# Altium project Micromouse-aDual.PrjPcb
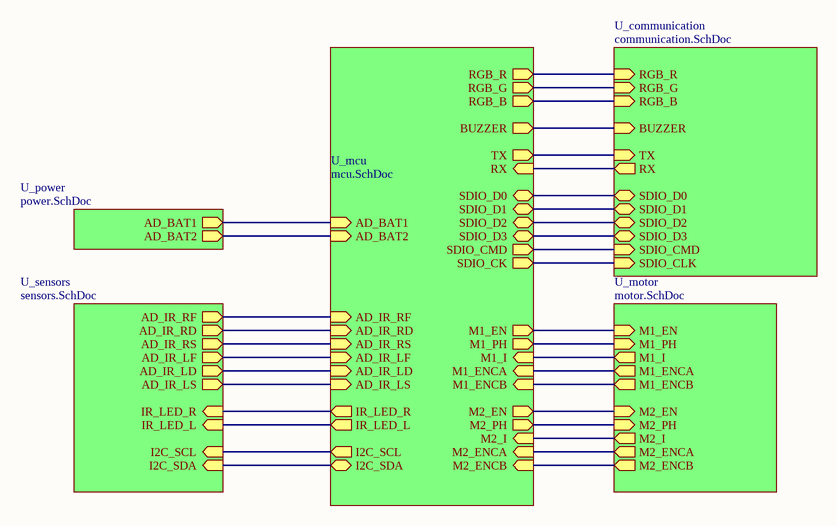
[diagram p0: Hierarchi.SchDoc]
6 sheets, 108 parts. Net scope: hierarchical (ports join the sheet entries above them; power ports are global).
Board file: aDual_v2.PcbDoc
Sheets:
  Hierarchi.SchDoc
    U_mcu = mcu.SchDoc
    U_motor = motor.SchDoc
    U_power = power.SchDoc
    U_sensors = sensors.SchDoc
    U_communication = communication.SchDoc

## Sheet Hierarchi.SchDoc
size A

### Sub-sheets
U_communication = communication.SchDoc: BUZZER (in), RGB_R (in), RGB_B (in), RGB_G (in), SDIO_D2 (bidir), SDIO_D3 (bidir), SDIO_CMD (in), SDIO_CLK (in), SDIO_D0 (bidir), SDIO_D1 (bidir), RX (out), TX (in)
U_mcu = mcu.SchDoc: AD_IR_LF (in), AD_IR_RF (in), AD_IR_LS (in), AD_IR_RS (in), AD_IR_RD (in), AD_IR_LD (in), M1_ENCA (in), M1_ENCB (in), M1_EN (out), M1_PH (out), M1_I (in), M2_EN (out), AD_BAT1 (in), AD_BAT2 (in), M2_PH (out), M2_I (in), M2_ENCA (in), M2_ENCB (in), I2C_SCL (out), I2C_SDA (bidir), IR_LED_L (out), IR_LED_R (out), SDIO_D3 (bidir), RX (in), RGB_R (out), BUZZER (out), RGB_G (out), TX (out), SDIO_D1 (bidir), SDIO_CK (out), SDIO_D0 (bidir), RGB_B (out), SDIO_CMD (out), SDIO_D2 (bidir)
U_motor = motor.SchDoc: M1_EN (in), M1_PH (in), M1_I (out), M1_ENCA (out), M1_ENCB (out), M2_EN (in), M2_PH (in), M2_I (out), M2_ENCA (out), M2_ENCB (out)
U_power = power.SchDoc: AD_BAT1 (out), AD_BAT2 (out)
U_sensors = sensors.SchDoc: AD_IR_LF (out), AD_IR_RD (out), AD_IR_LS (out), AD_IR_RS (out), AD_IR_LD (out), AD_IR_RF (out), I2C_SDA (in), I2C_SCL (in), IR_LED_L (in), IR_LED_R (in)

### Nets
AD_BAT1: sheet U_mcu/AD_BAT1, sheet U_power/AD_BAT1
AD_BAT2: sheet U_mcu/AD_BAT2, sheet U_power/AD_BAT2
AD_IR_LD: sheet U_mcu/AD_IR_LD, sheet U_sensors/AD_IR_LD
AD_IR_LF: sheet U_mcu/AD_IR_LF, sheet U_sensors/AD_IR_LF
AD_IR_LS: sheet U_mcu/AD_IR_LS, sheet U_sensors/AD_IR_LS
AD_IR_RD: sheet U_mcu/AD_IR_RD, sheet U_sensors/AD_IR_RD
AD_IR_RF: sheet U_mcu/AD_IR_RF, sheet U_sensors/AD_IR_RF
AD_IR_RS: sheet U_mcu/AD_IR_RS, sheet U_sensors/AD_IR_RS
BUZZER: sheet U_mcu/BUZZER, sheet U_communication/BUZZER
IR_LED_L: sheet U_mcu/IR_LED_L, sheet U_sensors/IR_LED_L
IR_LED_R: sheet U_mcu/IR_LED_R, sheet U_sensors/IR_LED_R
M1_EN: sheet U_mcu/M1_EN, sheet U_motor/M1_EN
M1_ENCA: sheet U_mcu/M1_ENCA, sheet U_motor/M1_ENCA
M1_ENCB: sheet U_mcu/M1_ENCB, sheet U_motor/M1_ENCB
M1_I: sheet U_mcu/M1_I, sheet U_motor/M1_I
M1_PH: sheet U_mcu/M1_PH, sheet U_motor/M1_PH
M2_EN: sheet U_mcu/M2_EN, sheet U_motor/M2_EN
M2_ENCA: sheet U_mcu/M2_ENCA, sheet U_motor/M2_ENCA
M2_ENCB: sheet U_mcu/M2_ENCB, sheet U_motor/M2_ENCB
M2_I: sheet U_mcu/M2_I, sheet U_motor/M2_I
M2_PH: sheet U_mcu/M2_PH, sheet U_motor/M2_PH
RGB_B: sheet U_mcu/RGB_B, sheet U_communication/RGB_B
RGB_G: sheet U_mcu/RGB_G, sheet U_communication/RGB_G
RGB_R: sheet U_mcu/RGB_R, sheet U_communication/RGB_R
RX: sheet U_mcu/RX, sheet U_communication/RX
SDIO_CK: sheet U_mcu/SDIO_CK, sheet U_communication/SDIO_CLK
SDIO_CMD: sheet U_mcu/SDIO_CMD, sheet U_communication/SDIO_CMD
SDIO_D0: sheet U_mcu/SDIO_D0, sheet U_communication/SDIO_D0
SDIO_D1: sheet U_mcu/SDIO_D1, sheet U_communication/SDIO_D1
SDIO_D2: sheet U_mcu/SDIO_D2, sheet U_communication/SDIO_D2
SDIO_D3: sheet U_mcu/SDIO_D3, sheet U_communication/SDIO_D3
TX: sheet U_mcu/TX, sheet U_communication/TX
NetIC4_19: sheet U_mcu/I2C_SCL, sheet U_sensors/I2C_SCL
NetIC4_20: sheet U_mcu/I2C_SDA, sheet U_sensors/I2C_SDA

## Sheet mcu.SchDoc: Micromouse aDual
size A
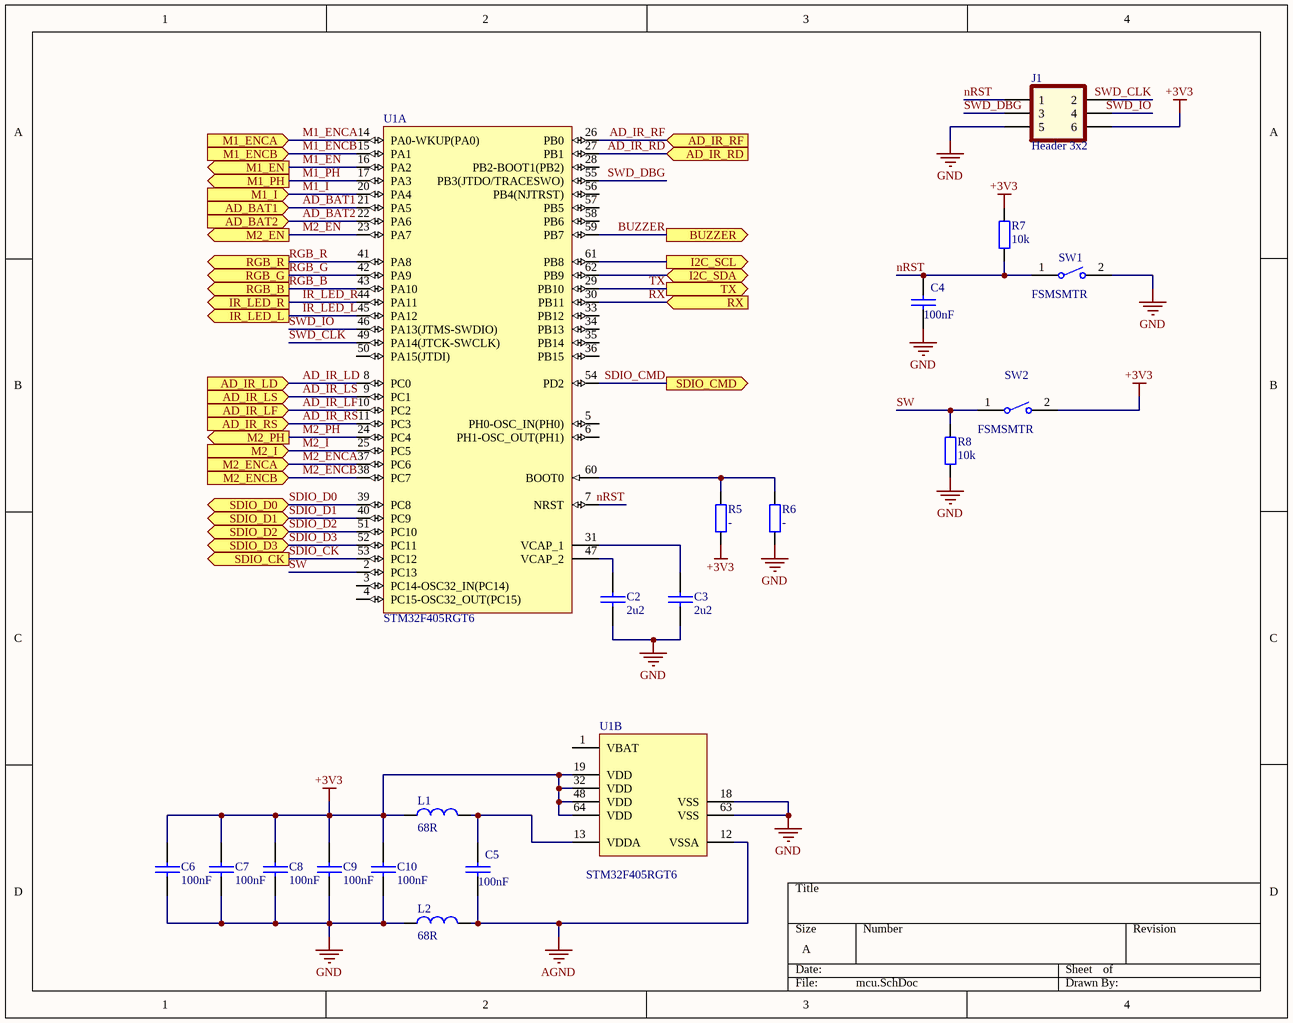
[diagram p1: mcu.SchDoc]

### Parts
C2  2u2  [C0402-Paste]
C3  2u2  [C0402-Paste]
C4  100nF  [C0402-Paste]
C5  100nF  [C0402-Paste]
C6  100nF  [C0402-Paste]
C7  100nF  [C0402-Paste]
C8  100nF  [C0402-Paste]
C9  100nF  [C0402-Paste]
C10  100nF  [C0402-Paste]
J1  Header 3x2  [CON-6x2]
L1  68R  [L0603_PASTE]
L2  68R  [L0603_PASTE]
R5  -  [R0402-Paste]
R6  -  [R0402-Paste]
R7  10k  [R0603_PASTE]
R8  10k  [R0603_PASTE]
SW1  FSMSMTR  [TECO-FSMSMTR_V]
SW2  FSMSMTR  [TECO-FSMSMTR_V]
U1  STM32F405RGT6  [STM-LQFP64_M]  (parts A,B of 2)

### Ports
AD_BAT1 (in), AD_BAT2 (in), AD_IR_LD (in), AD_IR_LF (in), AD_IR_LS (in), AD_IR_RD (in), AD_IR_RF (in), AD_IR_RS (in), BUZZER (out), I2C_SCL (out), I2C_SDA (bidir), IR_LED_L (out), IR_LED_R (out), M1_EN (out), M1_ENCA (in), M1_ENCB (in), M1_I (in), M1_PH (out), M2_EN (out), M2_ENCA (in), M2_ENCB (in), M2_I (in), M2_PH (out), RGB_B (out), RGB_G (out), RGB_R (out), RX (in), SDIO_CK (out), SDIO_CMD (out), SDIO_D0 (bidir), SDIO_D1 (bidir), SDIO_D2 (bidir), SDIO_D3 (bidir), TX (out)

### Nets
+3V3: C6.2 C7.2 C8.2 C9.2 C10.2 J1.6 L1.1 R5.2 R7.1 SW2.2 U1.19(VDD) U1.32(VDD) U1.48(VDD) U1.64(VDD)
AGND: C5.1 L2.2 U1.12(VSSA)
GND: C2.1 C3.1 C4.1 C6.1 C7.1 C8.1 C9.1 C10.1 J1.5 L2.1 R6.2 R8.2 SW1.2 U1.18(VSS) U1.63(VSS)
AD_BAT1: U1.21(PA5) ; port AD_BAT1
AD_BAT2: U1.22(PA6) ; port AD_BAT2
AD_IR_LD: U1.8(PC0) ; port AD_IR_LD
AD_IR_LF: U1.10(PC2) ; port AD_IR_LF
AD_IR_LS: U1.9(PC1) ; port AD_IR_LS
AD_IR_RD: U1.27(PB1) ; port AD_IR_RD
AD_IR_RF: U1.26(PB0) ; port AD_IR_RF
AD_IR_RS: U1.11(PC3) ; port AD_IR_RS
BUZZER: U1.59(PB7) ; port BUZZER
IR_LED_L: U1.45(PA12) ; port IR_LED_L
IR_LED_R: U1.44(PA11) ; port IR_LED_R
M1_EN: U1.16(PA2) ; port M1_EN
M1_ENCA: U1.14(PA0-WKUP(PA0)) ; port M1_ENCA
M1_ENCB: U1.15(PA1) ; port M1_ENCB
M1_I: U1.20(PA4) ; port M1_I
M1_PH: U1.17(PA3) ; port M1_PH
M2_EN: U1.23(PA7) ; port M2_EN
M2_ENCA: U1.37(PC6) ; port M2_ENCA
M2_ENCB: U1.38(PC7) ; port M2_ENCB
M2_I: U1.25(PC5) ; port M2_I
M2_PH: U1.24(PC4) ; port M2_PH
nRST: C4.2 J1.1 R7.2 SW1.1 U1.7(NRST)
RGB_B: U1.43(PA10) ; port RGB_B
RGB_G: U1.42(PA9) ; port RGB_G
RGB_R: U1.41(PA8) ; port RGB_R
RX: U1.30(PB11) ; port RX
SDIO_CK: U1.53(PC12) ; port SDIO_CK
SDIO_CMD: U1.54(PD2) ; port SDIO_CMD
SDIO_D0: U1.39(PC8) ; port SDIO_D0
SDIO_D1: U1.40(PC9) ; port SDIO_D1
SDIO_D2: U1.51(PC10) ; port SDIO_D2
SDIO_D3: U1.52(PC11) ; port SDIO_D3
SW: R8.1 SW2.1 U1.2(PC13)
SWD_CLK: J1.2 U1.49(PA14(JTCK-SWCLK))
SWD_DBG: J1.3 U1.55(PB3(JTDO/TRACESWO))
SWD_IO: J1.4 U1.46(PA13(JTMS-SWDIO))
TX: U1.29(PB10) ; port TX
NetC2_2: C2.2 U1.47(VCAP_2)
NetC3_2: C3.2 U1.31(VCAP_1)
NetC5_2: C5.2 L1.2 U1.13(VDDA)
NetIC4_19: U1.61(PB8) ; port I2C_SCL
NetIC4_20: U1.62(PB9) ; port I2C_SDA
NetR5_1: R5.1 R6.1 U1.60(BOOT0)

Not connected (* = marked no-connect by the designer): U1 1(VBAT) 3(PC14-OSC32_IN(PC14)) 4(PC15-OSC32_OUT(PC15)) 5(PH0-OSC_IN(PH0)) 6(PH1-OSC_OUT(PH1)) 28(PB2-BOOT1(PB2)) 33(PB12) 34(PB13) 35(PB14) 36(PB15) 50(PA15(JTDI)) 56(PB4(NJTRST)) 57(PB5) 58(PB6)

### Library data of the parts
C2-C10 = C-0402: CAP CER 0.1UF 16V Y5V 0402; Manufacturer: Samsung Electro-Mechanics; Manufacturer PN: CL05F104ZO5NNNC; Supplier: digikey.ca
  C2 C3: Value: 2u2
  C4-C10: Value: 100nF
J1 = Header 3x2: CONN HEADER VERT 6POS 2.54MM; Manufacturer: Sullins Connector Solutions; Manufacturer PN: PBC03DAAN; Value: Header 3x2; supplier: digikey.ca
L1 L2 = L-0603: FERRITE BEAD 0603; Manufacturer: Laird-Signal Integrity Products; Manufacturer PN: MI0603J680R-10; Value: 68R; Supplier: digikey.ca
R5 R6 = R-0402: RES SMD 0402; Value: -; Manufacturer: -; Manufacturer PN: -; Supplier: digikey.ca
R7 R8 = R-0603: RES SMD 0603; Value: 10k; Manufacturer: -; Manufacturer PN: -; Supplier: digikey.ca
SW1 SW2 = CMP-2000-07501-1: FSMSM Push Button Switch, 50 mA, -35 to 85 degC, 2-Pin SMD, RoHS, Tape and Reel; Manufacturer: TE Connectivity; Voltage Rating (DC): 24V; Electrical Life: 20000Cycles; Operating Force: 180gf; Switch Travel: 0.25mm; Contact Current Rating: 50mA; Case\/Package: SMD/SMT; Actuator Length: 1.07mm; Throw Configuration: SPST; Actuator Material: Polyamide; Contact Resistance: 100mOhm; Illumination Type: Illuminated; Max Voltage Rating (DC): 12V; Manufacturer URL: http://www.te.com/; Lead Free: LeadFree; Packaging: TapeandReel; Min Operating Temperature: -35degC; Mechanical Life: 20000Cycles; Mount: SurfaceMount; REACH SVHC: Unknown; Package Quantity: 1800; Package Reference: FSMSMTR; RoHSCompliant: true; Max Operating Temperature: 85degC; Orientation: Straight; ELV: Compliant; Datasheet URL: http://www.te.com/commerce/DocumentDelivery/DDEController?Action=showdoc&DocId=Customer+Drawing%7F1437566-3%7FC2%7Fpdf%7FEnglish%7FENG_CD_1437566-3_C2_1437566_3_1_c.dwg.pdf%7F1437566-4; Package Description: 2-Pin Surface Mount Device, Body 6 x 3.5 mm, Pitch 9.19 mm; Current Rating: 50mA; Contact Plating: Silver; Termination: GullWing; Datasheet Version: Rev. C2, 08/2014; Contact Material: Brass; Mounting Technology: SurfaceMount
U1 = CMP-0243-00019-3: ARM Cortex-M4 32-bit MCU+FPU, 210 DMIPS, 1024 kB Flash, 192 kB Internal RAM, 51 I/Os, 64-pin LQFP, -40 to 85 degC, Tray; Manufacturer: STMicroelectronics; Supply Voltage(Vcc) min (V): 1.8; Supply Voltage(Vcc) max (V): 3.6; Internal RAM Size (kB): 192; I/Os (High Current): 51; D/A Converter: 2x12-bit; FLASH Size (Prog) (kB): 1024; Operating Frequency(F) (Processor speed) (MHz): 168; ComponentLink2Description: Datasheet; PackageVersion: Rev. 4, 06/2013; DatasheetVersion: Rev. 4; Core: ARM Cortex-M4; ComponentLink2URL: http://www.st.com/st-web-ui/static/active/en/resource/technical/document/datasheet/DM00037051.pdf; PackageReference: LQFP64; Packing: Tray; ComponentLink1Description: Manufacturer URL; ComponentLink3URL: http://www.st.com/st-web-ui/static/active/en/resource/technical/document/datasheet/DM00037051.pdf; ComponentLink3Description: Package Specification; Mounting Technology: Surface Mount; ComponentLink1URL: http://www.st.com/web/en/home.html; PackageDescription: 64-Pin Low Profile Quad Flat Package, 10 x 10 mm Body, 0.5 mm Pitch; PartNumber: STM32F405RGT6

## Sheet motor.SchDoc
size A
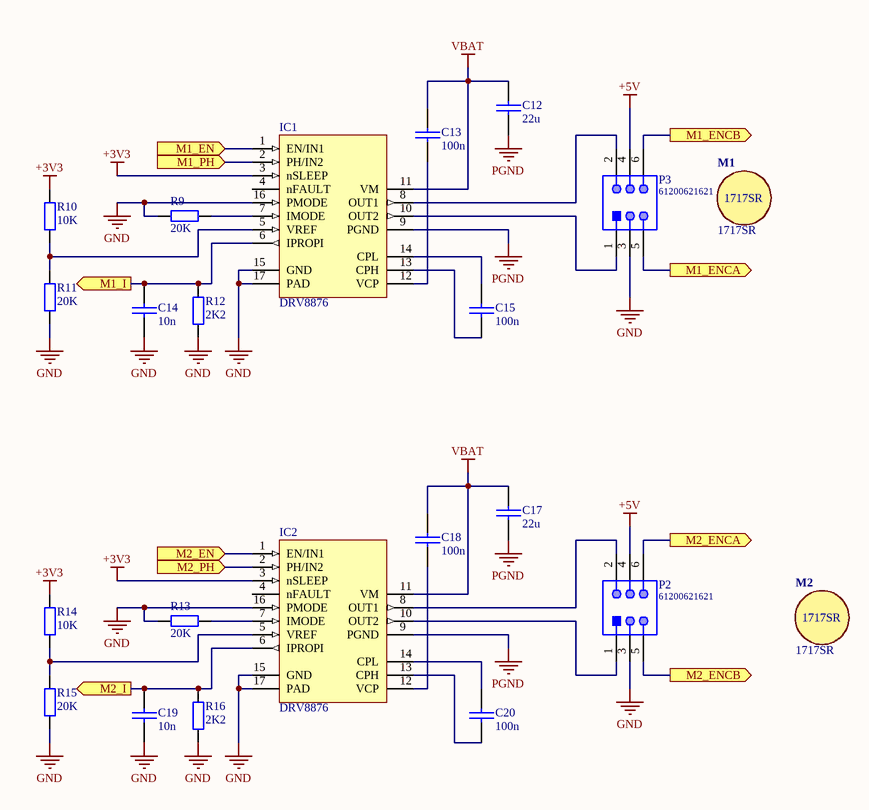
[diagram p2: motor.SchDoc]

### Parts
C12  22u  [C0603_PASTE]
C13  100n  [C0402-Paste]
C14  10n  [C0402-Paste]
C15  100n  [C0402-Paste]
C17  22u  [C0603_PASTE]
C18  100n  [C0402-Paste]
C19  10n  [C0402-Paste]
C20  100n  [C0402-Paste]
IC1  DRV8876  [TSSOP-16H]
IC2  DRV8876  [TSSOP-16H]
M1  1717SR  [Motor]
M2  1717SR  [Motor]
P2  61200621621  [61200621621]
P3  61200621621  [61200621621]
R9  20K  [R0402-Paste]
R10  10K  [R0402-Paste]
R11  20K  [R0402-Paste]
R12  2K2  [R0402-Paste]
R13  20K  [R0402-Paste]
R14  10K  [R0402-Paste]
R15  20K  [R0402-Paste]
R16  2K2  [R0402-Paste]

### Ports
M1_EN (in), M1_ENCA (out), M1_ENCB (out), M1_I (out), M1_PH (in), M2_EN (in), M2_ENCA (out), M2_ENCB (out), M2_I (out), M2_PH (in)

### Nets
+3V3: IC1.3(nSLEEP) IC2.3(nSLEEP) R10.2 R14.2
+5V: P2.4 P3.4
GND: C14.2 C19.2 IC1.15(GND) IC1.16(PMODE) IC1.17(PAD) IC2.15(GND) IC2.16(PMODE) IC2.17(PAD) P2.3 P3.3 R9.1 R11.1 R12.1 R13.1 R15.1 R16.1
PGND: C12.2 C17.2 IC1.9(PGND) IC2.9(PGND)
VBAT: C12.1 C13.1 C17.1 C18.1 IC1.11(VM) IC2.11(VM)
M1_EN: IC1.1(EN/IN1) ; port M1_EN
M1_ENCA: P3.5 ; port M1_ENCA
M1_ENCB: P3.6 ; port M1_ENCB
M1_I: C14.1 IC1.6(IPROPI) R12.2 ; port M1_I
M1_PH: IC1.2(PH/IN2) ; port M1_PH
M2_EN: IC2.1(EN/IN1) ; port M2_EN
M2_ENCA: P2.6 ; port M2_ENCA
M2_ENCB: P2.5 ; port M2_ENCB
M2_I: C19.1 IC2.6(IPROPI) R16.2 ; port M2_I
M2_PH: IC2.2(PH/IN2) ; port M2_PH
NetC13_2: C13.2 IC1.12(VCP)
NetC15_1: C15.1 IC1.14(CPL)
NetC15_2: C15.2 IC1.13(CPH)
NetC18_2: C18.2 IC2.12(VCP)
NetC20_1: C20.1 IC2.14(CPL)
NetC20_2: C20.2 IC2.13(CPH)
NetIC1_5: IC1.5(VREF) R10.1 R11.2
NetIC1_7: IC1.7(IMODE) R9.2
NetIC1_8: IC1.8(OUT1) P3.2
NetIC1_10: IC1.10(OUT2) P3.1
NetIC2_5: IC2.5(VREF) R14.1 R15.2
NetIC2_7: IC2.7(IMODE) R13.2
NetIC2_8: IC2.8(OUT1) P2.2
NetIC2_10: IC2.10(OUT2) P2.1

Not connected (* = marked no-connect by the designer): IC1 4(nFAULT); IC2 4(nFAULT)

### Library data of the parts
C12 C17 = C-0603: Multilayer Ceramic Capacitors MLCC - SMD 0603; Value: 22u; Manufacturer: -; Manufacturer PN: -; Supplier: digikey.ca
C13-C15 C18-C20 = C-0402: Multilayer Ceramic Capacitors MLCC - SMD  0402; Manufacturer: -; Manufacturer PN: -; Supplier: digikey.ca
  C13 C15 C18 C20: Value: 100n
  C14 C19: Value: 10n
IC1 IC2 = DRV8876: PWR MGMT MOTOR/FAN DRIVER; pin to pad: 17>HS; Supplier 1: Mouser; ComponentLink1Description: Digy-key; ComponentLink1URL: https://www.digikey.sk/product-detail/en/texas-instruments/DRV8876PWPR/296-53515-1-ND/10270213; ComponentLink2Description: Datasheet; ComponentLink2URL: www.ti.com/lit/ds/symlink/drv8876.pdf; Supplier Part Number 1: 595-DRV8876PWPR; Value: DRV8876
P2 P3 = CMP-1502-00000-1: Male Box Header WR-BHD, THT, Vertical, pitch 2.54 mm, 6 pins; Manufacturer: Wurth Elektronik; Withstanding Voltage: 500VAC; Working Voltage: 250VAC; Pin Number: 6; Pitch: 2.54mm; Contact Resistance: 20mOhm; Part Number: 61200621621; Manufacturer URL: http://www.we-online.de; Published Date: August2018; Orientation: Vertical; Publisher: WurthElektronik; Operating Temperature: -40to125degC; Datasheet URL: https://katalog.we-online.de/em/datasheet/6120xx21621.pdf; Mounting Technology: THT; Packaging: Tray; Gender: Male; Package Reference: 61200621621
R9-R16 = R-0402: RES SMD 0402; Manufacturer: -; Manufacturer PN: -; Supplier: digikey.ca
  R9 R11 R13 R15: Value: 20K
  R10 R14: Value: 10K
  R12 R16: Value: 2K2

## Sheet power.SchDoc
size A
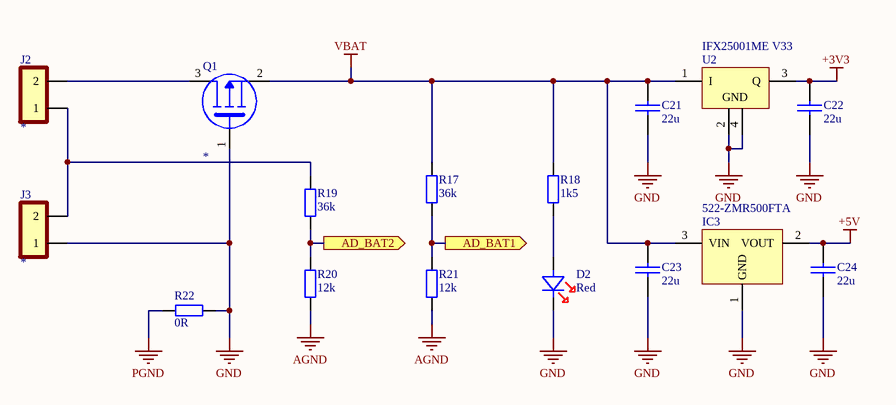
[diagram p3: power.SchDoc]

### Parts
C21  22u  [C0603_PASTE]
C22  22u  [C0603_PASTE]
C23  22u  [C0603_PASTE]
C24  22u  [C0603_PASTE]
D2  Red  [LED0402_RED]
IC3  Supplier Part Number 1: 522-ZMR500FTA  [SOT-23]  (hidden comment: ZMR500FTA)
J2  *  [CON-2x1-JMP]
J3  *  [CON-2x1-JMP]
Q1  *  [SOT-23]
R17  36k  [R0603_PASTE]
R18  1k5  [R0603_PASTE]
R19  36k  [R0603_PASTE]
R20  12k  [R0603_PASTE]
R21  12k  [R0603_PASTE]
R22  0R  [R0201-paste]
U2  IFX25001ME V33  [INF-PG-SOT223_SC-73_L]

### Ports
AD_BAT1 (out), AD_BAT2 (out)

### Nets
+3V3: C22.1 U2.3(Q)
+5V: C24.1 IC3.2(VOUT)
AGND: R20.2 R21.2
GND: C21.2 C22.2 C23.2 C24.2 D2.2(CATHODE) IC3.1(GND) J3.1 Q1.1(GATE) R22.2 U2.2(GND) U2.4(GND)
PGND: R22.1
VBAT: C21.1 C23.1 IC3.3(VIN) Q1.2(DRAIN) R17.1 R18.1 U2.1(I)
AD_BAT1: R17.2 R21.1 ; port AD_BAT1
AD_BAT2: R19.2 R20.1 ; port AD_BAT2
NetD2_1: D2.1(ANODE) R18.2
NetJ2_1: J2.1 J3.2 R19.1
NetJ2_2: J2.2 Q1.3(SOURCE)

### Library data of the parts
C21-C24 = C-0603: as C12 on sheet motor; Value: 22u; Manufacturer: -; Manufacturer PN: -; Supplier: digikey.ca
D2 = LED_0402_Red: Standard LEDs - SMD SMD 0402 Red; Manufacturer PN: XZMDK68W-2; Manufacturer: SunLED; Value: Red; Supplier: digikey.com
IC3 = ZMR500FTA: IC REG LINEAR 5V 50MA SOT23-3; Manufacturer 1: Diodes Zetex; Max Input Voltage: 25V; Min Input Voltage: 7V; Number of Outputs: 1; Max Power Dissipation: 500mW; Polarity: Positive; Output Type: Fixed; Dropout Voltage: 1.2V; Quiescent Current: 30uA; Power Supply Rejection Ratio (PSRR): 55dB; Supplier 1: Mouser; Manufacturer Part Number 1: ZMR500FTA; Stock 1: 9051; Pricing 1: 1=0.91000, 10=0.76000, 100=0.49000, 1000=0.39200, 3000=0.39200, 9000=0.39200 (USD); RoHS: Yes; Mount: Surface Mount; Case/Package: SOT-23; Number of Pins: 3; Weight: 0.000282oz; Min Operating Temperature: -55°C; Max Operating Temperature: 125°C; Output Voltage: 5V; Max Output Current: 50mA; Nominal Output Voltage: 5V; Packaging: Tape and Reel; Output Current: 50mA; Package Quantity: 3000; Power Rating: 500mW; Number of Regulators: 1; Power Dissipation: 500mW; Min Output Voltage: 5V; Length: 3.04mm; Height: 1.02mm; Width: 1.4mm; Radiation Hardening: No; REACH SVHC: No SVHC; Lead Free: Lead Free; ComponentLink1URL: https://datasheet.ciiva.com/15111/getdatasheetpartid-74239-15111397.pdf?src-supplier=Verical; ComponentLink1Description: https://datasheet.ciiva.com/15111/getdatasheetpartid-74239-15111397.pdf?src-supplier=Verical; ComponentLink2URL: https://datasheet.ciiva.com/5786/60079-5786598.pdf?src-supplier=Farnell; ComponentLink2Description: https://datasheet.ciiva.com/5786/60079-5786598.pdf?src-supplier=Farnell; ComponentLink3URL: https://datasheet.ciiva.com/26907/zmr500fta-26907457.pdf?src-supplier=IIIC; ComponentLink3Description: https://datasheet.ciiva.com/26907/zmr500fta-26907457.pdf?src-supplier=IIIC; ComponentLink4URL: https://datasheet.ciiva.com/8078/60079-8078251.pdf?src-supplier=Element14; ComponentLink4Description: https://datasheet.ciiva.com/8078/60079-8078251.pdf?src-supplier=Element14; ComponentLink5URL: https://datasheet.ciiva.com/8078/60079-8078252.pdf?src-supplier=Element14; ComponentLink5Description: https://datasheet.ciiva.com/8078/60079-8078252.pdf?src-supplier=Element14; ComponentLink6URL: https://datasheet.ciiva.com/16217/zmrseries-16217950.pdf?src-supplier=Future+Electronics; ComponentLink6Description: https://datasheet.ciiva.com/16217/zmrseries-16217950.pdf?src-supplier=Future+Electronics; ComponentLink7URL: https://datasheet.ciiva.com/8240/zmrseries-8240239.pdf?src-supplier=Avnet; ComponentLink7Description: https://datasheet.ciiva.com/8240/zmrseries-8240239.pdf?src-supplier=Avnet
J2 J3 = CON-2x1-JMP: 2 Positions Header 2.54mm; Manufacturer: Molex, LLC; Manufacturer PN: 0901200762; Value: *; Supplier: digikey.ca
Q1 = MOSFET-P: MOSFET P-CH  SOT23; Manufacturer PN: DMG2305UX-13; Manufacturer: Diodes Incorporated; Value: *; Supplier: digikey.ca
R17-R21 = R-0603: RES SMD 0603; Manufacturer: -; Manufacturer PN: -; Supplier: digikey.ca
  R17 R19: Value: 36k
  R18: Value: 1k5
  R20 R21: Value: 12k
R22 = R-0201: RES SMD 0201; Value: 0R; Manufacturer: -; Manufacturer PN: -; Supplier: digikey.ca
U2 = CMP-1136-00017-1: Low Dropout Voltage Regulator, 4.7 to 40 V Operating, 400 mA, -40 to 125 degC, PG-SOT223 (SC-73), Reel, Green; Manufacturer: Infineon; Typical Quiescent Current: 100 uA; Regulator Type: Linear->single output; Accuracy: 4.0Â %; Green: TRUE; Automotive Qualified: FALSE; Max Peak Reflow Temp: 260Â degreesC; Output Voltage: 3.3 V; Max. Output Current: 400 mA; Max Number Reflow: 3; Dropout Voltage: 700 mV; ComponentLink3URL: http://www.infineon.com/dgdl/SOT223-Package_Overview.pdf?folderId=db3a30431936bc4b0119530470b03c3d&fileId=db3a30431936bc4b0119531d40b93c5c; Packing: Reel; ComponentLink2Description: Datasheet; DatasheetVersion: Rev. 1.02; PackageDescription: 4-Pin Small Outline Transistor Package, 6.5 x 3.5 mm Body, 2.3 mm Pitch; MSL: 1; PackageVersion: Apr-08; Reset: FALSE; ComponentLink1URL: http://www.infineon.com/; PartNumber: IFX25001ME V33; ComponentLink1Description: Manufacturer URL; ComponentLink3Description: Package Specification; ComponentLink2URL: http://www.infineon.com/dgdl/IFX25001_DS_102.pdf?folderId=db3a30431ff988150120802bce1d257a&fileId=db3a304320d39d590120f620f1e269da; Status Output: FALSE; Mounting Technology: Surface Mount; PackageReference: PG-SOT223 (SC-73)

## Sheet sensors.SchDoc
size A
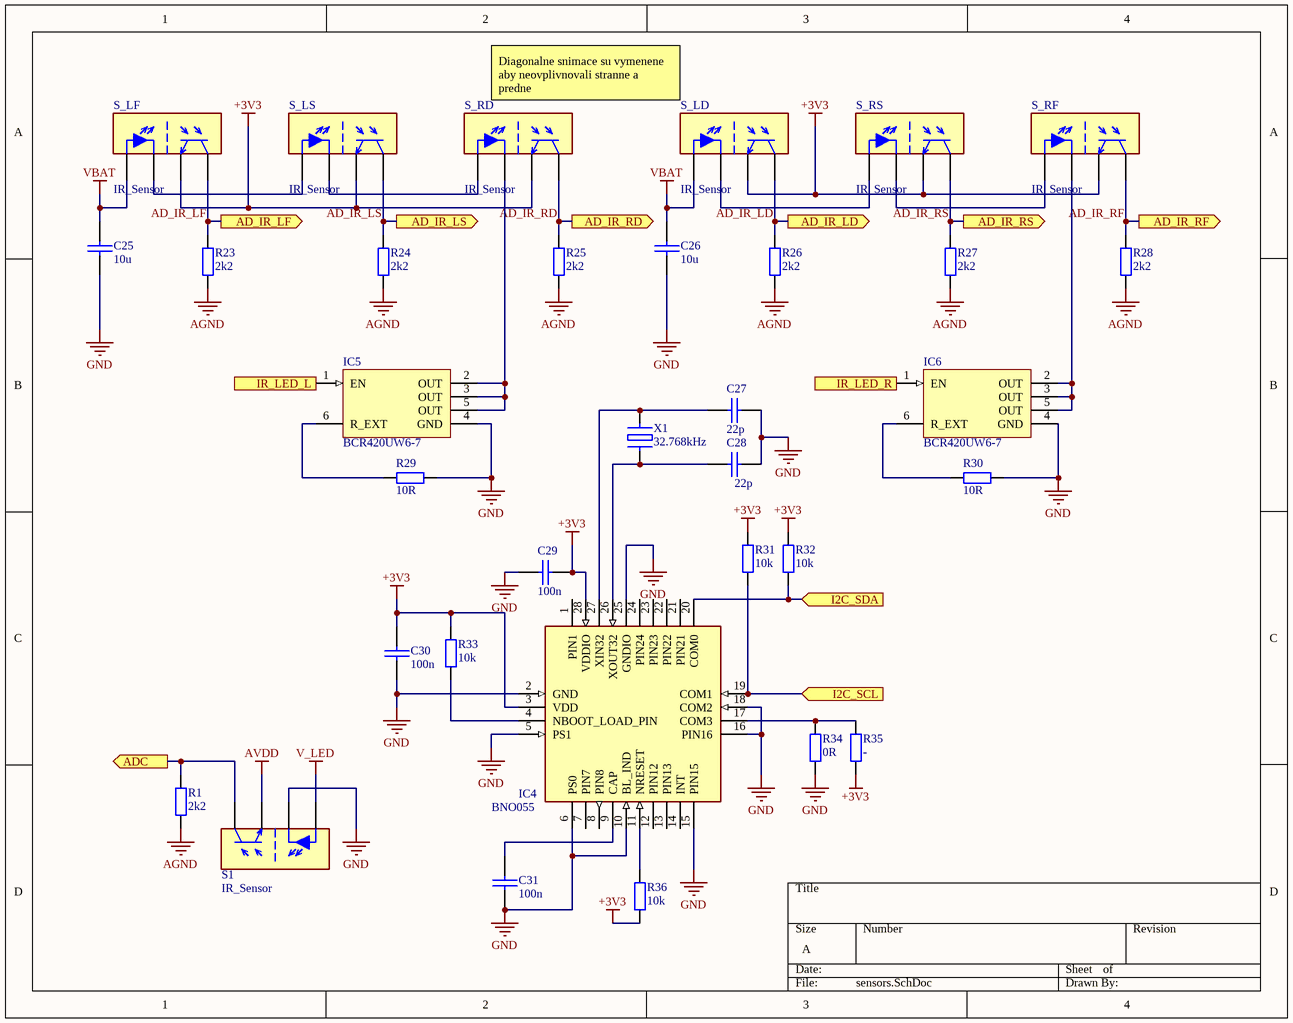
[diagram p4: sensors.SchDoc]

### Parts
(Parts that share a designator on the sheet are numbered #1, #2 ... from top to bottom, then left to right.)
C25  10u  [C0805_Paste]
C26  10u  [C0805_Paste]
C27  22p  [C0402-Paste]
C28  22p  [C0402-Paste]
C29  100n  [C0402-Paste]
C30  100n  [C0402-Paste]
C31  100n  [C0402-Paste]
IC4  BNO055  [BNO055]
IC5  Manufacturer Part Number 1: BCR420UW6-7  [SOT-23-6]  (hidden comment: *)
IC6  Manufacturer Part Number 1: BCR420UW6-7  [SOT-23-6]  (hidden comment: *)
R1#1  2k2  [R0402-Paste]
R23  2k2  [R0402-Paste]
R24  2k2  [R0402-Paste]
R25  2k2  [R0402-Paste]
R26  2k2  [R0402-Paste]
R27  2k2  [R0402-Paste]
R28  2k2  [R0402-Paste]
R29  10R  [R0805_PASTE]
R30  10R  [R0805_PASTE]
R31  10k  [R0402-Paste]
R32  10k  [R0402-Paste]
R33  10k  [R0402-Paste]
R34  0R  [R0402-Paste]
R35  -  [R0402-Paste]
R36  10k  [R0402-Paste]
S1  IR_Sensor  [IR_Sensor]
S_LD  IR_Sensor  [IR_Sensor]
S_LF  IR_Sensor  [IR_Sensor]
S_LS  IR_Sensor  [IR_Sensor]
S_RD  IR_Sensor  [IR_Sensor]
S_RF  IR_Sensor  [IR_Sensor]
S_RS  IR_Sensor  [IR_Sensor]
X1  32.768kHz  [CM250C]

### Ports
AD_IR_LD (out), AD_IR_LF (out), AD_IR_LS (out), AD_IR_RD (out), AD_IR_RF (out), AD_IR_RS (out), ADC (out), I2C_SCL (in), I2C_SDA (in), IR_LED_L (in), IR_LED_R (in)

### Nets
+3V3: C29.2 C30.1 IC4.3(VDD) IC4.28(VDDIO) R31.1 R32.1 R33.1 R35.2 R36.2 S_LD.DwR(TRANSCEIVER_C) S_LF.DwR(TRANSCEIVER_C) S_LS.DwR(TRANSCEIVER_C) S_RD.DwR(TRANSCEIVER_C) S_RF.DwR(TRANSCEIVER_C) S_RS.DwR(TRANSCEIVER_C)
AGND: R1#1.2 R23.2 R24.2 R25.2 R26.2 R27.2 R28.2
AVDD: S1.DwR(TRANSCEIVER_C)
GND: C25.2 C26.2 C27.2 C28.2 C29.1 C30.2 C31.2 IC4.2(GND) IC4.5(PS1) IC4.6(PS0) IC4.10(BL_IND) IC4.15(PIN15) IC4.16(PIN16) IC4.18(COM2) IC4.25(GNDIO) IC5.4(GND) IC6.4(GND) R29.2 R30.2 R34.2 S1.TopR(LED_K)
V_LED: S1.TopL(LED_A)
VBAT: C25.1 C26.1 S_LD.TopL(LED_A) S_LF.TopL(LED_A)
AD_IR_LD: R26.1 S_LD.DwL(TRANSCEIVER_E) ; port AD_IR_LD
AD_IR_LF: R23.1 S_LF.DwL(TRANSCEIVER_E) ; port AD_IR_LF
AD_IR_LS: R24.1 S_LS.DwL(TRANSCEIVER_E) ; port AD_IR_LS
AD_IR_RD: R25.1 S_RD.DwL(TRANSCEIVER_E) ; port AD_IR_RD
AD_IR_RF: R28.1 S_RF.DwL(TRANSCEIVER_E) ; port AD_IR_RF
AD_IR_RS: R27.1 S_RS.DwL(TRANSCEIVER_E) ; port AD_IR_RS
IR_LED_L: IC5.1(EN) ; port IR_LED_L
IR_LED_R: IC6.1(EN) ; port IR_LED_R
NetC27_1: C27.1 IC4.27(XIN32) X1.4
NetC28_1: C28.1 IC4.26(XOUT32) X1.1
NetC31_1: C31.1 IC4.9(CAP)
NetIC4_4: IC4.4(NBOOT_LOAD_PIN) R33.2
NetIC4_11: IC4.11(NRESET) R36.1
NetIC4_17: IC4.17(COM3) R34.1 R35.1
NetIC4_19: IC4.19(COM1) R31.2 ; port I2C_SCL
NetIC4_20: IC4.20(COM0) R32.2 ; port I2C_SDA
NetIC5_2: IC5.2(OUT) IC5.3(OUT) IC5.5(OUT) S_RD.TopR(LED_K)
NetIC5_6: IC5.6(R_EXT) R29.1
NetIC6_2: IC6.2(OUT) IC6.3(OUT) IC6.5(OUT) S_RF.TopR(LED_K)
NetIC6_6: IC6.6(R_EXT) R30.1
NetR1#1_1: R1#1.1 S1.DwL(TRANSCEIVER_E) ; port ADC
NetS_LD_TopR: S_LD.TopR(LED_K) S_RS.TopL(LED_A)
NetS_LF_TopR: S_LF.TopR(LED_K) S_LS.TopL(LED_A)
NetS_LS_TopR: S_LS.TopR(LED_K) S_RD.TopL(LED_A)
NetS_RF_TopL: S_RF.TopL(LED_A) S_RS.TopR(LED_K)

Not connected (* = marked no-connect by the designer): IC4 1(PIN1) 7(PIN7) 8(PIN8) 12(PIN12) 13(PIN13) 14(INT) 21(PIN21) 22(PIN22) 23(PIN23) 24(PIN24)

### Notes on the sheet
- Diagonalne snimace su vymenene aby neovplivnovali stranne a predne

### Library data of the parts
C25 C26 = C-0805: Multilayer Ceramic Capacitors MLCC - SMD 0805; Value: 10u; Manufacturer: -; Manufacturer PN: -; Supplier: digikey.ca
C27-C31 = C-0402: as C13 on sheet motor; Manufacturer: -; Manufacturer PN: -; Supplier: digikey.ca
  C27 C28: Value: 22p
  C29-C31: Value: 100n
IC4 = BNO055: Integrated Circuit; Manufacturer_Name: Bosch Sensortec; Datasheet Link: https://ae-bst.resource.bosch.com/media/_tech/media/datasheets/BST_BNO055_DS000_14.pdf; Height: 1mm; Manufacturer_Part_Number: BNO055; Mouser Part Number: 262-BNO055; Mouser Price/Stock: https://www.mouser.com/Search/Refine.aspx?Keyword=262-BNO055
IC5 IC6 = BCR420UW6: IC LED DRIVER SOT26; Manufacturer 1: Diodes; Number of Outputs: 1; Max Supply Voltage: 40V; Output Current per Channel: 350mA; Min Output Voltage: 1.4V; Max Output Current: 11mA; Dimming: PWM; Supplier 1: Mouser; Stock 1: 108388; Pricing 1: 1=0.39000, 10=0.29700, 100=0.16100, 1000=0.12100, 3000=0.10400, 9000=0.09800 (USD); RoHS: Yes; Mount: Surface Mount; Case/Package: SOT-23-6; Number of Pins: 6; Min Operating Temperature: -55°C; Max Operating Temperature: 150°C; Packaging: Tape and Reel; Output Voltage: 40V; Max Output Voltage: 40V; Number of Channels: 1; ComponentLink1URL: http://www.mouser.com/ds/2/115/BCR420UW6_BCR421UW6-553387.pdf?src-supplier=Mouser; ComponentLink1Description: http://www.mouser.com/ds/2/115/BCR420UW6_BCR421UW6-553387.pdf?src-supplier=Mouser; ComponentLink2URL: http://www.diodes.com/_files/datasheets/BCR420UW6_BCR421UW6.pdf?src-supplier=Avnet; ComponentLink2Description: http://www.diodes.com/_files/datasheets/BCR420UW6_BCR421UW6.pdf?src-supplier=Avnet; ComponentLink3URL: https://www.diodes.com/assets/Datasheets/BCR420UW6-BCR421UW7.pdf?src-supplier=Digi-Key; ComponentLink3Description: https://www.diodes.com/assets/Datasheets/BCR420UW6-BCR421UW7.pdf?src-supplier=Digi-Key; Parameter 1: *; Parameter 2: *; Parameter 3: *; Parameter 4: *; Supplier Part Number 1: 621-BCR420UW6-7; Parameter 5: *; Parameter 6: *; Parameter 7: *; Parameter 8: *; Parameter 9: *; Parameter 10: *; Parameter 11: *; Parameter 12: *; Parameter 13: *; Parameter 14: *; Parameter 15: *; Parameter 16: *; Parameter 17: *; Parameter 18: *
R1#1 R23-R28 R31-R36 = R-0402: RES SMD 0402; Manufacturer: -; Manufacturer PN: -; Supplier: digikey.ca
  R1#1 R23-R28: Value: 2k2
  R31-R33 R36: Value: 10k
  R34: Value: 0R
  R35: Value: -
R29 R30 = R-0805: RES SMD 0805; Value: 10R; Manufacturer: -; Manufacturer PN: -; Supplier: digikey.ca
X1 = Xtal: CRYSTAL; Manufacturer PN: CM250C100000AZFT; Manufacturer: Citizen Finedevice Co Ltd; Value: 32.768kHz; Supplier: digikey.ca
S1 S_LD S_LF S_LS S_RD S_RF S_RS = IR_Sensor: Terminal pitch: 2.54mm

## Sheet communication.SchDoc
size A
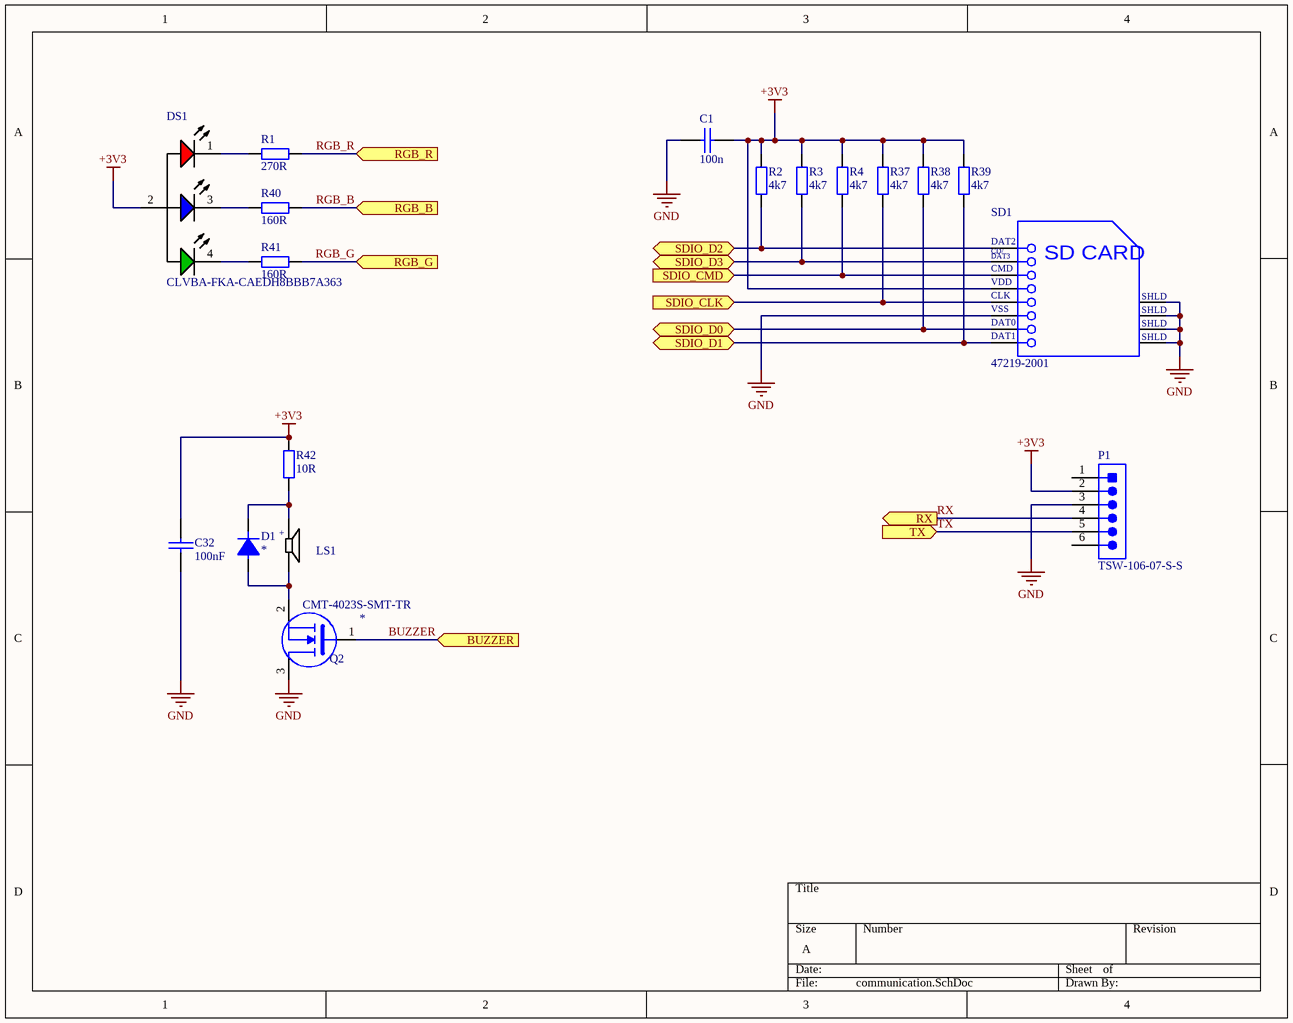
[diagram p5: communication.SchDoc]

### Parts
(Parts that share a designator on the sheet are numbered #1, #2 ... from top to bottom, then left to right.)
C1  100n  [C0603_PASTE]
C32  100nF  [C0402-Paste]
D1  *  [SOD123]
DS1  CLVBA-FKA-CAEDH8BBB7A363  [CLVBA-FKA_RGB_A_V]
LS1  CMT-4023S-SMT-TR  [*CUI_CMT-4023S-SMT-TR_CMT-4023S-SMT-TR(Primary)]
P1  TSW-106-07-S-S  [SMTC-TSW-106-07-S-S_V]
Q2  *  [SOT-23]
R1#2  270R  [R0603_PASTE]
R2  4k7  [R0603_PASTE]
R3  4k7  [R0603_PASTE]
R4  4k7  [R0603_PASTE]
R37  4k7  [R0603_PASTE]
R38  4k7  [R0603_PASTE]
R39  4k7  [R0603_PASTE]
R40  160R  [R0603_PASTE]
R41  160R  [R0603_PASTE]
R42  10R  [R0603_PASTE]
SD1  47219-2001  [MOLX-47219-2001-8_V]

### Ports
BUZZER (in), RGB_B (in), RGB_G (in), RGB_R (in), RX (out), SDIO_CLK (in), SDIO_CMD (in), SDIO_D0 (bidir), SDIO_D1 (bidir), SDIO_D2 (bidir), SDIO_D3 (bidir), TX (in)

### Nets
+3V3: C1.1 C32.2 DS1.2(COMMON) P1.2 R2.1 R3.1 R4.1 R37.1 R38.1 R39.1 R42.1 SD1.4(VDD)
GND: C1.2 C32.1 P1.3 Q2.3(SOURCE) SD1.6(VSS) SD1.9(SHLD) SD1.10(SHLD) SD1.11(SHLD) SD1.12(SHLD)
BUZZER: Q2.1(GATE) ; port BUZZER
RGB_B: R40.1 ; port RGB_B
RGB_G: R41.1 ; port RGB_G
RGB_R: R1#2.1 ; port RGB_R
RX: P1.4 ; port RX
SDIO_CK: R37.2 SD1.5(CLK) ; port SDIO_CLK
SDIO_CMD: R4.2 SD1.3(CMD) ; port SDIO_CMD
SDIO_D0: R38.2 SD1.7(DAT0) ; port SDIO_D0
SDIO_D1: R39.2 SD1.8(DAT1) ; port SDIO_D1
SDIO_D2: R2.2 SD1.1(DAT2) ; port SDIO_D2
SDIO_D3: R3.2 SD1.2(CD/DAT3) ; port SDIO_D3
TX: P1.5 ; port TX
NetD1_A: D1.A LS1.N Q2.2(DRAIN)
NetD1_K: D1.K LS1.P R42.2
NetDS1_1: DS1.1(RED) R1#2.2
NetDS1_3: DS1.3(BLUE) R40.2
NetDS1_4: DS1.4(GREEN) R41.2

Not connected (* = marked no-connect by the designer): P1 1 6

### Notes on the sheet
- (in symbol CMP-2000-05245-1) CD/; DAT3; SD CARD
- (in symbol CMT-4023S-SMT-TR) +

### Library data of the parts
C1 = C-0603: as C12 on sheet motor; Value: 100n; Manufacturer: -; Manufacturer PN: -; Supplier: digikey.ca
C32 = C-0402: as C2 on sheet mcu; Value: 100nF; Supplier: digikey.ca
D1 = DIODE: Common Diode; Manufacturer: ON Semiconductor; Manufacturer PN: LL4148; Value: *; Supplier: digikey.ca
DS1 = CMP-2000-06112-1: 3-in-1 SMD Led, 1.9 V Red, 3 V Green, 3 V Blue, -40 to 100 degC, 4-Pin PLCC, RoHS, Reel; Luminous Intensity: 71mcd,140mcd,36mcd; Viewing Angle: 120deg; Brand: Cree,Inc.; Lens Color/Style: UVTinted; Forward Current: 20mA; LED Size: 3.2mmx2.8mmx1.9mm; Wavelength/Color Temperature: 630nm,527nm,470nm; Forward Voltage: 1.9V,3V,3V; Illumination Color: RGB; Package / Case: PLCC-4; Package Reference: PLCC-4; Packaging: Reel; Maximum Operating Temperature: +100C; Minimum Operating Temperature: -40C; Product Category: StandardLEDs-SMD; Manufacturer URL: http://www.cree.com/; RoHS: Details; Factory Pack Quantity: 2000; Datasheet URL: http://datasheet.octopart.com/CLVBA-FKA-CAEDH8BBB7A363-Cree-datasheet-44497822.pdf; Manufacturer: Cree,Inc.; Mounting Technology: SurfaceMount; Package Description: 4-Pin Plastic Leaded Chip Carrier, Body 3.2 x 2.8 mm; Datasheet Version: 12/2014
LS1 = CMT-4023S-SMT-TR: 4 mm, 3 Vo-p, 70 dB, Surface Mount _SMT_, Magnetic Audio Transducer Buzzer; MF: CUI Devices; CUI_purchase_URL: https://www.cuidevices.com/product/audio/buzzers/audio-transducers/cmt-4023s-smt-tr?utm_source=snapeda.com&utm_medium=referral&utm_campaign=snapedaBOM; SnapEDA_Link: https://www.snapeda.com/parts/CMT-4023S-SMT-TR/CUI%20Devices/view-part/612102/?ref=snap; Availability: Unavailable; Price: None; Package: SIP-1 CUI; MP: CMT-4023S-SMT-TR; Value: *
P1 = CMP-1681-00007-2: Male Header, Pitch 2.54 mm, 1 x 6 Position, Height 8.38 mm, Tail Length 2.54 mm, -55 to 125 degC, RoHS, Bulk; Manufacturer: Samtec; Rows: 1; Contact Finish: Gold; Lead Pitch: 0.1 inch; Package Quantity: 1; Mounting Technology: Through Hole; ComponentLink1Description: Manufacturer URL; Contact Plating: Gold; DatasheetVersion: 12/2015; ComponentLink3Description: Package Specification; PackageDescription: Male Header, Pitch 2.54 mm, 1 x 6 Position, Height 8.38 mm, Tail Length 2.54 mm; Height: 8.38 mm; ComponentLink2Description: Datasheet; RoHSCompliant: true; Colour: Black; Packaging: Bulk; Min Operating Temperature: -55 degC; ComponentLink2URL: http://suddendocs.samtec.com/catalog_english/tsw_th.pdf; Mount: Through Hole; PackageReference: TSW-102-07-S-S; Pins: 6; Max Operating Temperature: 125 degC; ComponentLink3URL: http://suddendocs.samtec.com/prints/tsw-xxx-xx-x-x-xx-xxx-footprint.pdf; Length: 15.24 mm; Contact Material: Bronze; ComponentLink1URL: http://www.samtec.com/
Q2 = MOSFET-N: MOSFET N-CH  SOT23; Manufacturer PN: BSN20-7; Manufacturer: Diodes Incorporated; Value: *; Supplier: digikey.ca
R1#2 R2-R4 R37-R42 = R-0603: RES SMD 0603; Manufacturer: -; Manufacturer PN: -; Supplier: digikey.ca
  R1#2: Value: 270R
  R2-R4 R37-R39: Value: 4k7
  R40 R41: Value: 160R
  R42: Value: 10R
SD1 = CMP-2000-05245-1: MicroSD Card Connector, Hinge Type, -40 to 85 degC, 8-Pin SMD, RoHS, Tape and Reel; Manufacturer: Molex; Current Rating: 500mA; Number of Contacts: 8; Pitch: 1.09mm; Insertion - Extraction Style: Hinged; Voltage Rating: 100VDC; Product: CardConnectors; Contact Material: CopperAlloy; Series: 47219; Packaging: Reel; Brand: Molex; Product Category: MemoryCardConnectors; Housing Material: Thermoplastic; Mounting Style: SMD/SMT; Termination Style: SMD; Datasheet Version: Rev. F, 06/2009; Card Type: microSD; Manufacturer URL: http://www.molex.com/; RoHS: Details; Datasheet URL: http://www.molex.com/pdm_docs/sd/472192001_sd.pdf; Factory Pack Quantity: 2400

## Nets that join several sheets
+3V3: mcu (14 pins), motor (IC1.3 IC2.3 R10.2 R14.2), power (C22.1 U2.3), sensors (15 pins), communication (12 pins)
+5V: motor (P2.4 P3.4), power (C24.1 IC3.2)
AGND: mcu (C5.1 L2.2 U1.12), power (R20.2 R21.2), sensors (7 pins)
GND: mcu (15 pins), motor (16 pins), power (11 pins), sensors (21 pins), communication (9 pins)
PGND: motor (C12.2 C17.2 IC1.9 IC2.9), power (R22.1)
VBAT: motor (6 pins), power (7 pins), sensors (C25.1 C26.1 S_LD.TopL S_LF.TopL)
AD_BAT1: mcu (U1.21), power (R17.2 R21.1)
AD_BAT2: mcu (U1.22), power (R19.2 R20.1)
AD_IR_LD: mcu (U1.8), sensors (R26.1 S_LD.DwL)
AD_IR_LF: mcu (U1.10), sensors (R23.1 S_LF.DwL)
AD_IR_LS: mcu (U1.9), sensors (R24.1 S_LS.DwL)
AD_IR_RD: mcu (U1.27), sensors (R25.1 S_RD.DwL)
AD_IR_RF: mcu (U1.26), sensors (R28.1 S_RF.DwL)
AD_IR_RS: mcu (U1.11), sensors (R27.1 S_RS.DwL)
BUZZER: mcu (U1.59), communication (Q2.1)
IR_LED_L: mcu (U1.45), sensors (IC5.1)
IR_LED_R: mcu (U1.44), sensors (IC6.1)
M1_EN: mcu (U1.16), motor (IC1.1)
M1_ENCA: mcu (U1.14), motor (P3.5)
M1_ENCB: mcu (U1.15), motor (P3.6)
M1_I: mcu (U1.20), motor (C14.1 IC1.6 R12.2)
M1_PH: mcu (U1.17), motor (IC1.2)
M2_EN: mcu (U1.23), motor (IC2.1)
M2_ENCA: mcu (U1.37), motor (P2.6)
M2_ENCB: mcu (U1.38), motor (P2.5)
M2_I: mcu (U1.25), motor (C19.1 IC2.6 R16.2)
M2_PH: mcu (U1.24), motor (IC2.2)
NetIC4_19: mcu (U1.61), sensors (IC4.19 R31.2)
NetIC4_20: mcu (U1.62), sensors (IC4.20 R32.2)
RGB_B: mcu (U1.43), communication (R40.1)
RGB_G: mcu (U1.42), communication (R41.1)
RGB_R: mcu (U1.41), communication (R1#2.1)
RX: mcu (U1.30), communication (P1.4)
SDIO_CK: mcu (U1.53), communication (R37.2 SD1.5)
SDIO_CMD: mcu (U1.54), communication (R4.2 SD1.3)
SDIO_D0: mcu (U1.39), communication (R38.2 SD1.7)
SDIO_D1: mcu (U1.40), communication (R39.2 SD1.8)
SDIO_D2: mcu (U1.51), communication (R2.2 SD1.1)
SDIO_D3: mcu (U1.52), communication (R3.2 SD1.2)
TX: mcu (U1.29), communication (P1.5)